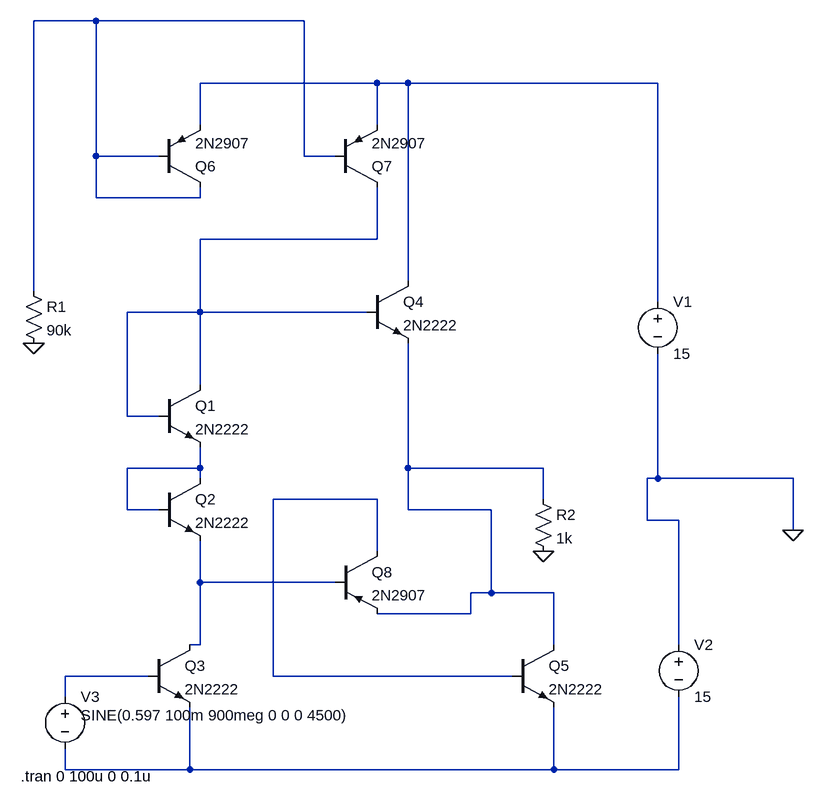
[diagram p0: schematic Draft1.asc]
Draft1.asc, the LTspice schematic file:
Version 4
SHEET 1 1252 796
WIRE 160 -384 64 -384
WIRE 480 -384 160 -384
WIRE 592 -288 320 -288
WIRE 640 -288 592 -288
WIRE 1024 -288 640 -288
WIRE 320 -224 320 -288
WIRE 592 -224 592 -288
WIRE 160 -176 160 -384
WIRE 256 -176 160 -176
WIRE 480 -176 480 -384
WIRE 528 -176 480 -176
WIRE 160 -112 160 -176
WIRE 320 -112 320 -128
WIRE 320 -112 160 -112
WIRE 592 -48 592 -128
WIRE 592 -48 320 -48
WIRE 640 16 640 -288
WIRE 64 32 64 -384
WIRE 1024 48 1024 -288
WIRE 320 64 320 -48
WIRE 320 64 208 64
WIRE 576 64 320 64
WIRE 320 176 320 64
WIRE 208 224 208 64
WIRE 256 224 208 224
WIRE 320 304 320 272
WIRE 320 304 208 304
WIRE 640 304 640 112
WIRE 848 304 640 304
WIRE 320 320 320 304
WIRE 1024 320 1024 128
WIRE 1024 320 1008 320
WIRE 1232 320 1024 320
WIRE 592 352 432 352
WIRE 848 352 848 304
WIRE 208 368 208 304
WIRE 256 368 208 368
WIRE 640 368 640 304
WIRE 768 368 640 368
WIRE 1008 384 1008 320
WIRE 1056 384 1008 384
WIRE 1232 400 1232 320
WIRE 592 432 592 352
WIRE 320 480 320 416
WIRE 528 480 320 480
WIRE 768 496 768 368
WIRE 768 496 736 496
WIRE 864 496 768 496
WIRE 736 528 736 496
WIRE 736 528 592 528
WIRE 320 576 320 480
WIRE 320 576 304 576
WIRE 864 576 864 496
WIRE 1056 576 1056 384
WIRE 240 624 112 624
WIRE 432 624 432 352
WIRE 800 624 432 624
WIRE 112 656 112 624
WIRE 112 768 112 736
WIRE 304 768 304 672
WIRE 304 768 112 768
WIRE 864 768 864 672
WIRE 864 768 304 768
WIRE 1056 768 1056 656
WIRE 1056 768 864 768
FLAG 1232 400 0
FLAG 848 432 0
FLAG 64 112 0
SYMBOL res 48 16 R0
SYMATTR InstName R1
SYMATTR Value 90k
SYMBOL voltage 1024 32 R0
SYMATTR InstName V1
SYMATTR Value 15
SYMBOL voltage 1056 560 R0
SYMATTR InstName V2
SYMATTR Value 15
SYMBOL voltage 112 640 R0
WINDOW 3 24 44 Left 2
WINDOW 123 0 0 Left 0
WINDOW 39 0 0 Left 0
SYMATTR InstName V3
SYMATTR Value SINE(0.597 100m 900meg 0 0 0 4500)
SYMBOL res 832 336 R0
SYMATTR InstName R2
SYMATTR Value 1k
SYMBOL npn 256 176 R0
SYMATTR InstName Q1
SYMATTR Value 2N2222
SYMBOL npn 256 320 R0
SYMATTR InstName Q2
SYMATTR Value 2N2222
SYMBOL npn 240 576 R0
SYMATTR InstName Q3
SYMATTR Value 2N2222
SYMBOL npn 576 16 R0
SYMATTR InstName Q4
SYMATTR Value 2N2222
SYMBOL npn 800 576 R0
SYMATTR InstName Q5
SYMATTR Value 2N2222
SYMBOL pnp 256 -128 M180
SYMATTR InstName Q6
SYMATTR Value 2N2907
SYMBOL pnp 528 -128 M180
SYMATTR InstName Q7
SYMATTR Value 2N2907
SYMBOL pnp 528 432 R0
SYMATTR InstName Q8
SYMATTR Value 2N2907
TEXT 44 778 Left 2 !.tran 0 100u 0 0.1u

The netlist it stands for:
* Draft1.asc
R1 N001 0 90k
V1 N002 0 15
V2 0 N009 15
V3 N008 N009 SINE(0.597 100m 900meg 0 0 0 4500)
R2 N005 0 1k
Q1 N003 N003 N004 0 2N2222
Q2 N004 N004 N007 0 2N2222
Q3 N007 N008 N009 0 2N2222
Q4 N002 N003 N005 0 2N2222
Q5 N005 N006 N009 0 2N2222
Q6 N001 N001 N002 0 2N2907
Q7 N003 N001 N002 0 2N2907
Q8 N006 N007 N005 0 2N2907
.model NPN NPN
.model PNP PNP
.lib standard.bjt
.tran 0 100u 0 0.1u
.backanno
.end